# EAGLE design PCB-TBAR-BO (EAGLE 6.2)
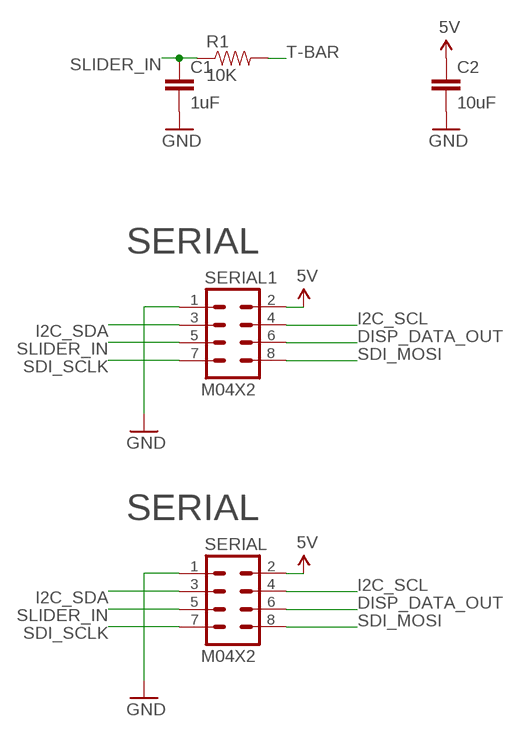
[diagram p0: schematic, sheet 1]

## Parts
C1  1uF  CAP0603-CAP  [0603-CAP]
C2  10uF  CAP0603-CAP  [0603-CAP]
R1  10K  RESISTOR0603-RES  [0603-RES]
SERIAL  M04X2  [2X4]
SERIAL1  M04X2  [2X4]

## Nets
5V [Power]: C2.1 SERIAL1.2 SERIAL.2
DISP_DATA_OUT: SERIAL1.6 SERIAL.6
GND [Power]: C1.2 C2.2 SERIAL1.1 SERIAL.1
I2C_SCL: SERIAL1.4 SERIAL.4
I2C_SDA: SERIAL1.3 SERIAL.3
SDI_MOSI: SERIAL1.8 SERIAL.8
SDI_SCLK: SERIAL1.7 SERIAL.7
SLIDER_IN: C1.1 R1.1 SERIAL1.5 SERIAL.5
T-BAR: R1.2

## Notes on the sheet
- SERIAL
- SERIAL

## Library data of the parts
C1 C2 = SparkFun:CAP: Capacitor Standard 0603 ceramic capacitor, and 0.1" leaded capacitor.
R1 = SparkFun:RESISTOR: Resistor Basic schematic elements and footprints for 0603, 1206, and PTH resistors.
SERIAL SERIAL1 = SparkFun:M04X2

## Net classes
0 default: width 0.203 mm, drill 0.406 mm, clearance 0.203 mm
1 Power: width 0.406 mm, drill 0.61 mm, clearance 0.203 mm

## Board
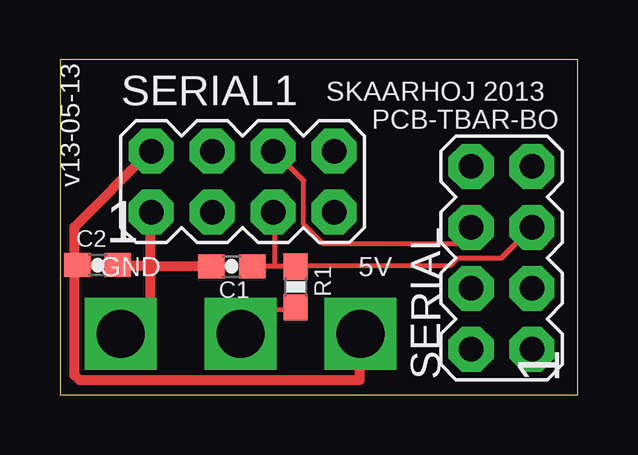
[diagram p1: board, top side]
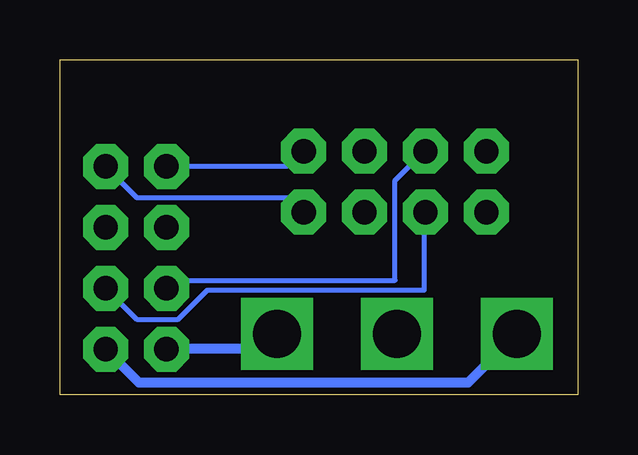
[diagram p2: board, bottom side, seen from below]

Size 21.59 x 13.97 mm. Coordinates in mm from the lower left corner, seen from the top.
Outline: 0,0 21.59,0 21.59,13.97 0,13.97 0,0
Copper layers (1*16): Top 0.035mm / dielectric 1.5mm / Bottom 0.035mm
Design rules "default": minimum track width 6mil, minimum drill 12mil, track to track 6mil, track to pad 6mil, pad to pad 6mil, via to via 6mil, smd to smd 0mil, copper to edge 10mil, drill to drill 10mil, minimum pad ring 10mil, minimum via ring 6mil, stop-mask expansion 2mil, vias tented up to drill 100mil, thermal gap 10mil

### Footprints (pad centres in the part's own frame; a part is rotated, then mirrored left to right if it is on the bottom)
0603-CAP = smd 1.1 x 1: 1 -0.85,0; 2 0.85,0
0603-RES = smd 1.1 x 1: 1 -0.85,0; 2 0.85,0
2X4 = drill 1.016 pad 1.88 octagon: 1 -3.81,-1.27; 2 -3.81,1.27; 3 -1.27,-1.27; 4 -1.27,1.27; 5 1.27,-1.27; 6 1.27,1.27; 7 3.81,-1.27; 8 3.81,1.27

### Placement (x,y rotation side)
C1  7.16,5.36 180 top
C2  1.57,5.41 0 top
R1  9.83,4.5 270 top
SERIAL  18.41,5.71 90 top
SERIAL1  7.62,8.89 0 top

### Tracks (layer width: path | path; a pad name or v marks a point on that pad's centre or on a via)
5V  (via drill 2)
  Top 0.406: 0.61,5.38 0.61,0.81 0.81,0.61 12.5,0.61 12.5,2.54 v12.54,2.54 | 0.61,5.38 0.61,7.01 3.76,10.16 SERIAL1.2 | C2.1 0.71,5.38 0.61,5.38
  Bottom 0.406: v12.54,2.54 12.6,2.54 13.21,1.93 17.07,1.93 SERIAL.2
DISP_DATA_OUT
  Top 0.203: SERIAL1.6 8.94,10.16 10.16,8.94 10.16,7.11 10.97,6.3 17.07,6.3 17.07,6.91 SERIAL.6
GND  (via drill 2)
  Top 0.406: v2.54,2.54 3.76,3.76 3.76,5.38 | 3.76,5.38 3.76,7.62 SERIAL1.1 | 3.76,5.38 6.3,5.38 C1.2 | 3.76,5.38 2.44,5.38 C2.2
  Bottom 0.406: SERIAL.1 18.29,0.51 4.57,0.51 v2.54,2.54
I2C_SCL
  Bottom 0.203: SERIAL1.4 6.4,10.16 7.62,8.94 7.62,4.78 16.76,4.78 17.07,4.47 SERIAL.4
I2C_SDA
  Bottom 0.203: SERIAL.3 18.39,3.15 16.66,3.15 15.44,4.37 6.4,4.37 6.4,7.62 SERIAL1.3
SDI_MOSI
  Bottom 0.203: SERIAL1.8 11.48,10.16 12.09,9.55 17.07,9.55 SERIAL.8
SDI_SCLK
  Bottom 0.203: SERIAL.7 18.39,8.23 12.09,8.23 11.48,7.62 SERIAL1.7
SLIDER_IN
  Top 0.203: 8.84,7.62 SERIAL1.5 8.94,7.62 8.94,5.38 | SERIAL.5 18.39,5.69 16.56,5.69 16.26,5.38 9.86,5.38 R1.1 9.75,5.38 8.94,5.38 | 8.94,5.38 8.03,5.38 C1.1
T-BAR  (via drill 2)
  Top 0.203: R1.2 9.75,3.56 7.62,3.56 7.62,2.54 v7.54,2.54

### Text on the board
_tsilk: v13-05-13 | SKAARHOJ 2013 | PCB-TBAR-BO | 1 | GND | 5V | 1